# Altium schematic sheet AdcPmodPsu.SchDoc
size A4
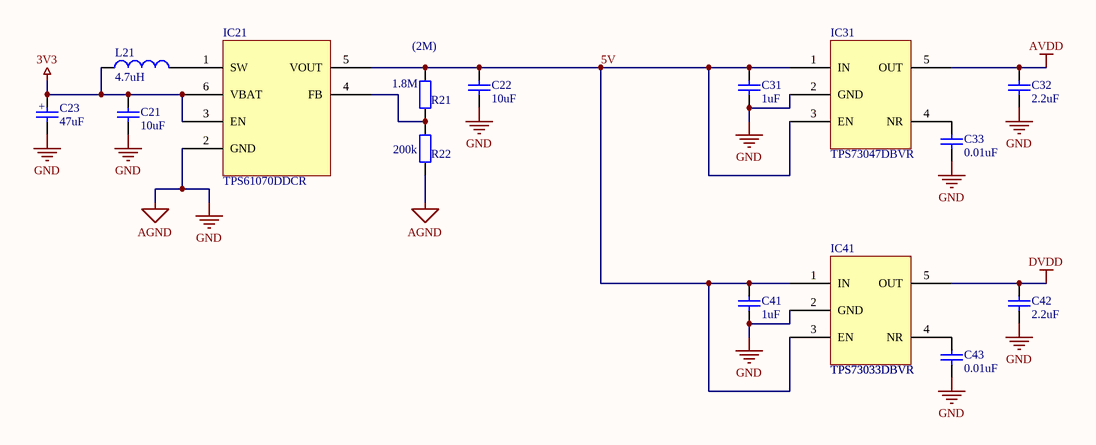
[diagram p0: AdcPmodPsu.SchDoc]

## Parts
C21  10uF  [CAP0805]
C22  10uF  [CAP0805]
C23  47uF  [CAP_POL1206]
C31  1uF  [CAP0805]
C32  2.2uF  [CAP0805]
C33  0.01uF  [CAP0805]
C41  1uF  [CAP0805]
C42  2.2uF  [CAP0805]
C43  0.01uF  [CAP0805]
IC21  TPS61070DDCR  [SOT23 (DDC TI)]
IC31  TPS73047DBVR  [SOT23 (5) (DBVTI)]
IC41  TPS73033DBVR  [SOT23 (5) (DBVTI)]
L21  4.7uH  [IND1206 (HS)]
R21  1.8M  [RES0805]
R22  200k  [RES0805]

## Nets
3V3: C21.2 C23.1 IC21.3(EN) IC21.6(VBAT) L21.1
AGND: C21.1 C22.1 C23.2 C31.1 C32.1 C33.1 C41.1 C42.1 C43.1 IC21.2(GND) IC31.2(GND) IC41.2(GND) R22.1  [also labelled GND]
AVDD: C32.2 IC31.5(OUT)
DVDD: C42.2 IC41.5(OUT)
5V: C22.2 C31.2 C41.2 IC21.5(VOUT) IC31.1(IN) IC31.3(EN) IC41.1(IN) IC41.3(EN) R21.2
NetC33_2: C33.2 IC31.4(NR)
NetC43_2: C43.2 IC41.4(NR)
NetIC21_1: IC21.1(SW) L21.2
NetIC21_4: IC21.4(FB) R21.1 R22.2

## Notes on the sheet
- (near R21) (2M)
- (in symbol CAP_POL) +

## Library data of the parts
C21 C22 = CAP: Ceramic X7R; Manufacturer: Murata Electronics; Mfr. Part No.: GRM21BR71A106KE51L; Suplier Part No.: 81-GRM21BR71A106KE51; Value: 10uF; Supplier: Mouser
C23 = CAP_POL: Capacitor Tantalum - Polymer; Manufacturer: Vishay / Polytech; Mfr. Part No.: T58A0476M010C0100; Suplier Part No.: 74-T58A0476M010C0100; Value: 47uF; Supplier: Mouser
C31 C41 = CAP: Ceramic X7R; Manufacturer: Murata Electronics; Mfr. Part No.: GRM21BR71A105KA01L; Suplier Part No.: 81-GRM40X105K10L; Value: 1uF; Supplier: Mouser
C32 C42 = CAP: Ceramic X7R; Manufacturer: Murata Electronics; Mfr. Part No.: GRM21BR71A225KA01L; Suplier Part No.: 81-GRM21BR71A225KA01; Value: 2.2uF; Supplier: Mouser
C33 C43 = CAP: Ceramic X7R; Manufacturer: Murata Electronics; Mfr. Part No.: GRM216R71E103KA01D; Suplier Part No.: 81-GRM216R71E103KA01; Value: 0.01uF; Supplier: Mouser
IC21 = TPS6107x: Adjustable, 600-mA Switch, 90% Efficient PFM/PWM Boost Converter; Manufacturer: Texas Instruments; Suplier Part No.: 595-TPS61070DDCR; Mfr. Part No.: TPS61070DDCR; Supplier: Mouser
IC31 = TPS730x: Manufacturer: Texas Instruments; Suplier Part No.: 595-TPS73047DBVR; Mfr. Part No.: TPS73047DBVR; Supplier: Mouser
IC41 = TPS730x: Manufacturer: Texas Instruments; Suplier Part No.: 595-TPS73033DBVT; Mfr. Part No.: TPS73033DBVR; Supplier: Mouser
L21 = IND: Inductor; Manufacturer: Murata Electronics; Mfr. Part No.: LQM31PN4R7M00L; Suplier Part No.: 81-LQM31PN4R7M00L; Value: 4.7uH; Supplier: Mouser
R21 = RES: Thick Film; Manufacturer: Vishay; Mfr. Part No.: CRCW12061M80FKEA; Suplier Part No.: 71-CRCW12061M80FKEA; Value: 1.8M; Supplier: Mouser
R22 = RES: Thin Film; Manufacturer: Vishay; Mfr. Part No.: TNPW1206200KBEEA; Suplier Part No.: 71-TNPW1206200KBEEA; Value: 200k; Supplier: Mouser